# Altium schematic sheet servo_headers.SchDoc
size A4
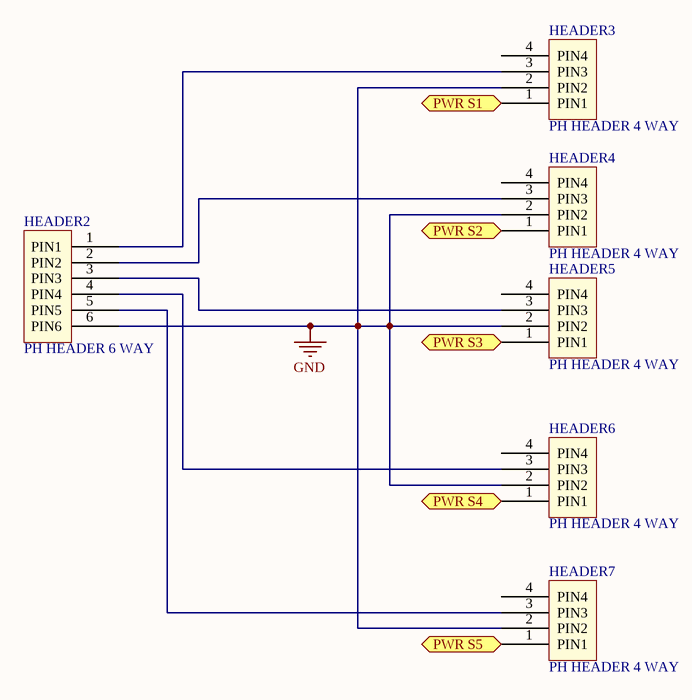
[diagram p0: servo_headers.SchDoc]

## Parts
HEADER2  PH HEADER 6 WAY  [PH CONNECTOR 6 WAY]
HEADER3  PH HEADER 4 WAY  [PH_HEADER 4WAY]
HEADER4  PH HEADER 4 WAY  [PH_HEADER 4WAY]
HEADER5  PH HEADER 4 WAY  [PH_HEADER 4WAY]
HEADER6  PH HEADER 4 WAY  [PH_HEADER 4WAY]
HEADER7  PH HEADER 4 WAY  [PH_HEADER 4WAY]

## Ports
PWR S1, PWR S2, PWR S3, PWR S4, PWR S5

## Nets
GND: HEADER2.6(PIN6) HEADER3.2(PIN2) HEADER4.2(PIN2) HEADER5.2(PIN2) HEADER6.2(PIN2) HEADER7.2(PIN2)
PWR S1: HEADER3.1(PIN1) ; port PWR S1
PWR S2: HEADER4.1(PIN1) ; port PWR S2
PWR S3: HEADER5.1(PIN1) ; port PWR S3
PWR S4: HEADER6.1(PIN1) ; port PWR S4
PWR S5: HEADER7.1(PIN1) ; port PWR S5
NetHEADER2_1: HEADER2.1(PIN1) HEADER3.3(PIN3)
NetHEADER2_2: HEADER2.2(PIN2) HEADER4.3(PIN3)
NetHEADER2_3: HEADER2.3(PIN3) HEADER5.3(PIN3)
NetHEADER2_4: HEADER2.4(PIN4) HEADER6.3(PIN3)
NetHEADER2_5: HEADER2.5(PIN5) HEADER7.3(PIN3)

Not connected (* = marked no-connect by the designer): HEADER3 4(PIN4); HEADER4 4(PIN4); HEADER5 4(PIN4); HEADER6 4(PIN4); HEADER7 4(PIN4)